# EAGLE design AUTO_plat (EAGLE 7.0.0)
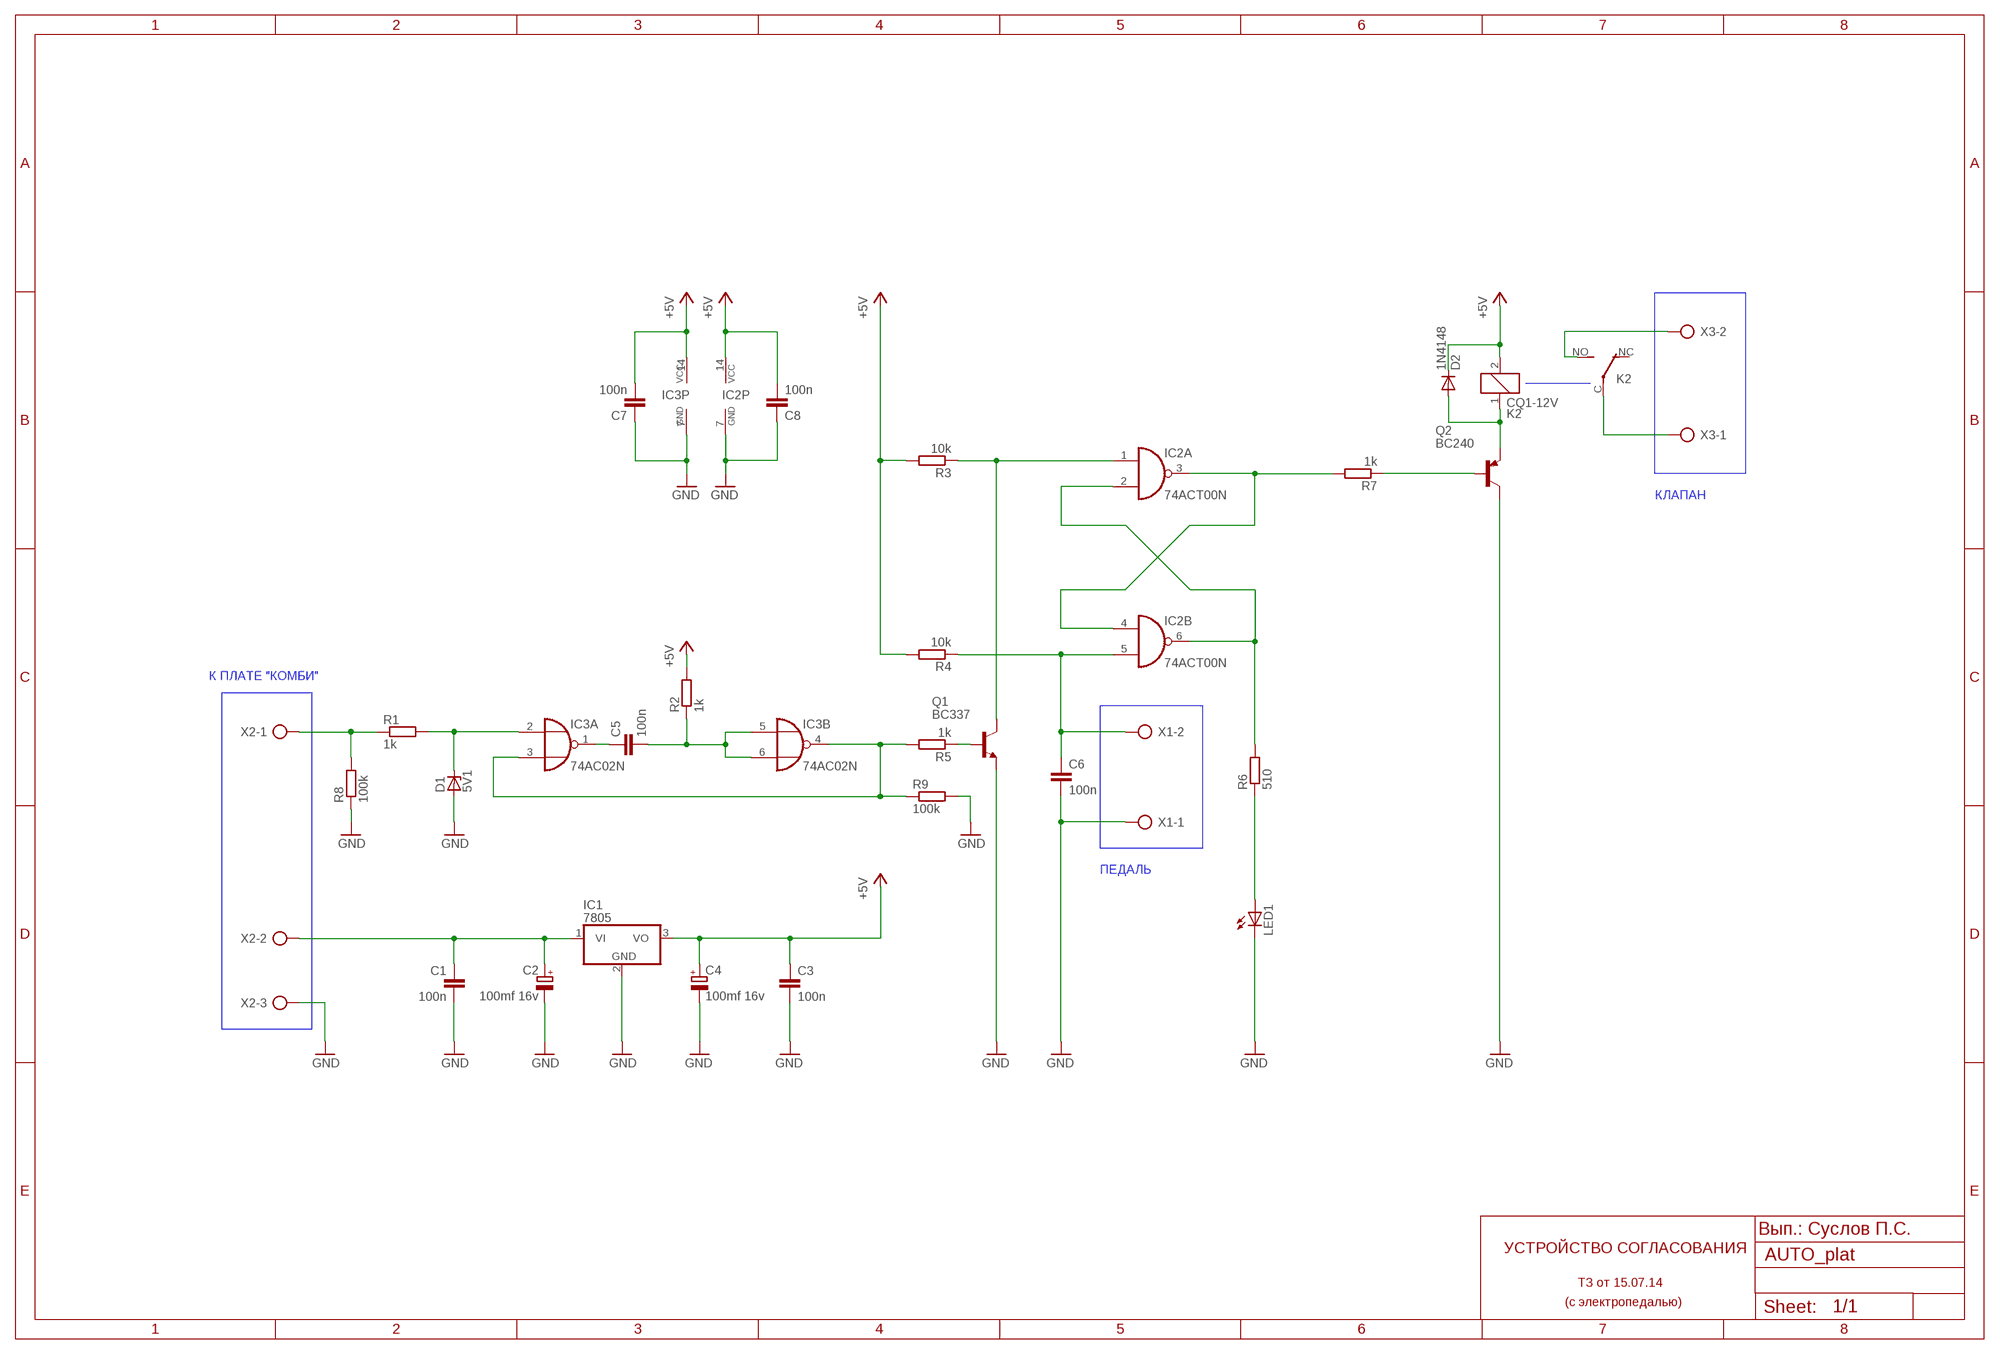
[diagram p0: schematic, sheet 1]

## Parts
C1  100n  C-EU025-030X050  [C025-030X050]
C2  100mf 16v  CPOL-EUE3.5-8  [E3,5-8]
C3  100n  C-EU025-030X050  [C025-030X050]
C4  100mf 16v  CPOL-EUE3.5-8  [E3,5-8]
C5  100n  C-EU025-030X050  [C025-030X050]
C6  100n  C-EU025-030X050  [C025-030X050]
C7  100n  C-EU025-030X050  [C025-030X050]
C8  100n  C-EU025-030X050  [C025-030X050]
D1  5V1  1N4728  [DO41Z10]
D2  1N4148  1N4148DO35-10  [DO35-10]
IC1  7805  786TV  [TO220V]
IC2  74ACT00N  [DIL14]
IC3  74AC02N  [DIL14]
K2  CQ1-12V  [CQ1]
LED1  LED3MM  [LED3MM]
Q1  BC337  [TO92]
Q2  BC240  BD240  [TO220]
R1  1k  R-EU_0207/10  [0207/10]
R2  1k  R-EU_0207/10  [0207/10]
R3  10k  R-EU_0207/10  [0207/10]
R4  10k  R-EU_0207/10  [0207/10]
R5  1k  R-EU_0207/10  [0207/10]
R6  510  R-EU_0207/10  [0207/10]
R7  1k  R-EU_0207/10  [0207/10]
R8  100k  R-EU_0207/10  [0207/10]
R9  100k  R-EU_0207/10  [0207/10]
X1  AK500/2  [AK500/2]
X2  AK500/3  [AK500/3]
X3  AK500/2  [AK500/2]

## Nets
+5V: C3.1 C4.+ C7.2 C8.2 D2.C IC1.3(VO) IC2.14(P:VCC) IC3.14(P:VCC) K2.2 R2.2 R3.2 R4.2
GND: C1.2 C2.- C3.2 C4.- C6.2 C7.1 C8.1 D1.A IC1.2(GND) IC2.7(P:GND) IC3.7(P:GND) LED1.K(C) Q1.1(E) Q2.2(C) R8.1 R9.2 X1.1 X2.3
N$1: C1.1 C2.+ IC1.1(VI) X2.2
N$4: R1.1 R8.2 X2.1
N$5: D1.C IC3.2(A:I0) R1.2
N$6: C5.1 IC3.1(A:O)
N$7: C5.2 IC3.5(B:I0) IC3.6(B:I1) R2.1
N$8: IC3.3(A:I1) IC3.4(B:O) R5.2 R9.1
N$9: IC2.3(A:O) IC2.4(B:I0) R7.2
N$10: IC2.2(A:I1) IC2.6(B:O) R6.2
N$11: IC2.1(A:I0) Q1.3(C) R3.1
N$13: C6.1 IC2.5(B:I1) R4.1 X1.2
N$15: Q1.2(B) R5.1
N$16: LED1.A R6.1
N$17: Q2.1(B) R7.1
N$18: D2.A K2.1 Q2.3(E)
N$21: K2.C(2:P) X3.1
N$22: K2.NO(2:S) X3.2
Unconnected: IC2.8(C:O) IC2.9(C:I0) IC2.10(C:I1) IC2.11(D:O) IC2.12(D:I0) IC2.13(D:I1) IC3.8(C:I0) IC3.9(C:I1) IC3.10(C:O) IC3.11(D:I0) IC3.12(D:I1) IC3.13(D:O) K2.NC(2:O)

## Notes on the sheet
- КЛАПАН
- К ПЛАТЕ "КОМБИ"
- ПЕДАЛЬ
- Вып.: Суслов П.С.
- УСТРОЙСТВО СОГЛАСОВАНИЯ
- ТЗ от 15.07.14
- (с электропедалью)

## Library data of the parts
C1 C3 C5-C8 = rcl:C-EU: CAPACITOR, European symbol
C2 C4 = rcl:CPOL-EU: POLARIZED CAPACITOR, European symbol
D1 = diode:1N4728: Z DIODE 3.3 V, 1W, 5 percent
D2 = diode:1N4148: DIODE high speed (Philips)
IC1 = linear:78*: Positive VOLTAGE REGULATOR Source: http://cache.national.com/ds/LM/LM78L05.pdf http://www.fairchildsemi.com/ds/LM/LM7805.pdf
IC2 = 74xx-eu:74*00: Quad 2-input NAND gate
IC3 = 74xx-eu:74*02: Quad 2-input NOR gate
K2 = relay:CQ1-12V: AUTOMOTIVE QUIET RELAY NAiS Source: http://www.mew-europe.com/.. en_ds_61208_0000.pdf; OC_FARNELL: unknown; OC_NEWARK: unknown
LED1 = led:LED: LED OSRAM: - CHIPLED LG R971, LG N971, LY N971, LG Q971, LY Q971, LO R971, LY R971 LH N974, LH R974 LS Q976, LO Q976, LY Q976 LO Q996 - Hyper CHIPLED LW Q18S LB Q993, LB Q99A, LB R99A - SideLED LS A670, LO A670, LY A670, LG A670, LP A670 LB A673, LV A673, LT A673, LW A673 LH A674 LY A675 LS A676, LA A676, LO A676, LY A676, LW A676 LS A679, LY A679, LG A679 - Hyper Micro SIDELED® LS Y876, LA Y876, LO Y876, LY Y876 LT Y87S - SmartLED LW L88C, LW L88S LB L89C, LB L89S, LG L890 LS L89K, LO L89K, LY L89K LS L896, LA L896, LO L896, LY L896 - TOPLED LS T670, LO T670, LY T670, LG T670, LP T670 LSG T670, LSP T670, LSY T670, LOP T670, LYG T670 LG T671, LOG T671, LSG T671 LB T673, LV T673, LT T673, LW T673 LH T674 LS T676, LA T676, LO T676, LY T676, LB T676, LH T676, LSB T676, LW T676 LB T67C, LV T67C, LT T67C, LS T67K, LO T67K, LY T67K, LW E67C LS E67B, LA E67B, LO E67B, LY E67B, LB E67C, LV E67C, LT E67C LW T67C LS T679, LY T679, LG T679 LS T770, LO T770, LY T770, LG T770, LP T770 LB T773, LV T773, LT T773, LW T773 LH T774 LS E675, LA E675, LY E675, LS T675 LS T776, LA T776, LO T776, LY T776, LB T776 LHGB T686 LT T68C, LB T68C - Hyper Mini TOPLED® LB M676 - Mini TOPLED Santana® LG M470 LS M47K, LO M47K, LY M47K Source: http://www.osram.convergy.de LUXEON: - LUMILED® LXK2-PW12-R00, LXK2-PW12-S00, LXK2-PW14-U00, LXK2-PW14-V00 LXK2-PM12-R00, LXK2-PM12-S00, LXK2-PM14-U00 LXK2-PE12-Q00, LXK2-PE12-R00, LXK2-PE12-S00, LXK2-PE14-T00, LXK2-PE14-U00 LXK2-PB12-K00, LXK2-PB12-L00, LXK2-PB12-M00, LXK2-PB14-N00, LXK2-PB14-P00, LXK2-PB14-Q00 LXK2-PR12-L00, LXK2-PR12-M00, LXK2-PR14-Q00, LXK2-PR14-R00 LXK2-PD12-Q00, LXK2-PD12-R00, LXK2-PD12-S00 LXK2-PH12-R00, LXK2-PH12-S00 LXK2-PL12-P00, LXK2-PL12-Q00, LXK2-PL12-R00 Source: www.luxeon.com KINGBRIGHT: KA-3528ASYC Source: www.kingbright.com
Q1 = transistor-npn:BC337*: NPN Transistor
Q2 = transistor-pnp:BD240: PNP Transistor
R1-R9 = rcl:R-EU_: RESISTOR, European symbol
X1 X3 = con-ptr500:AK500/2: CONNECTOR; OC_FARNELL: unknown; OC_NEWARK: unknown
X2 = con-ptr500:AK500/3: CONNECTOR; OC_FARNELL: unknown; OC_NEWARK: unknown

## Board
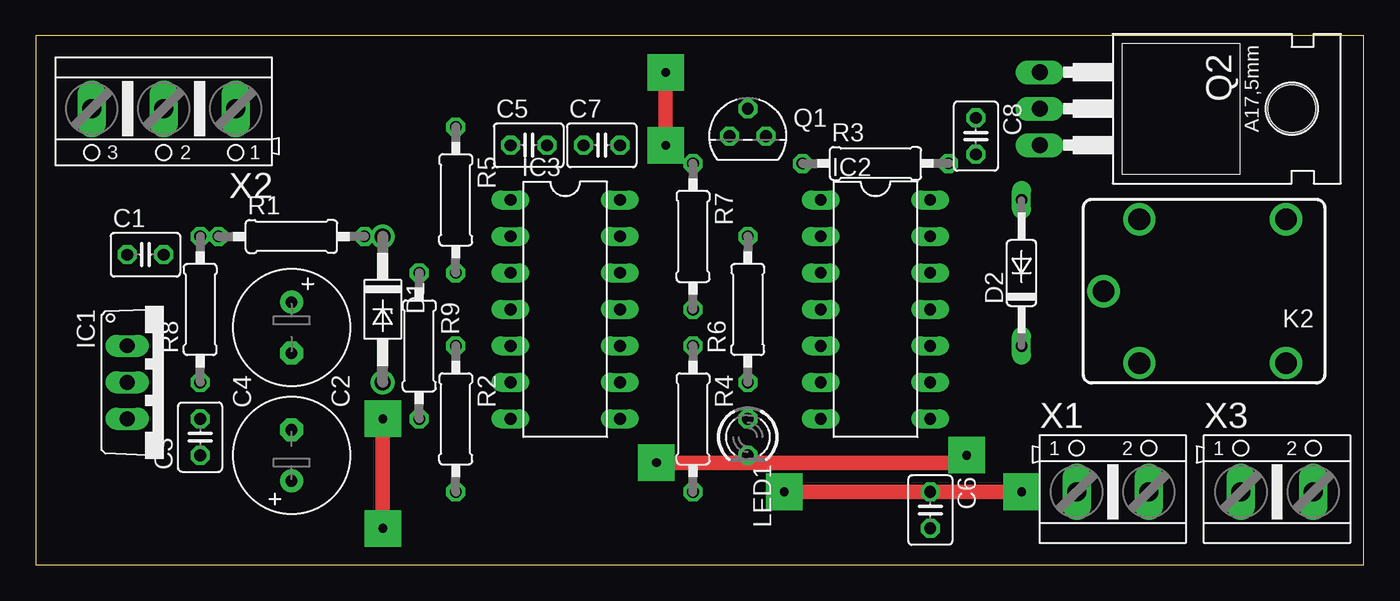
[diagram p1: board, top side]
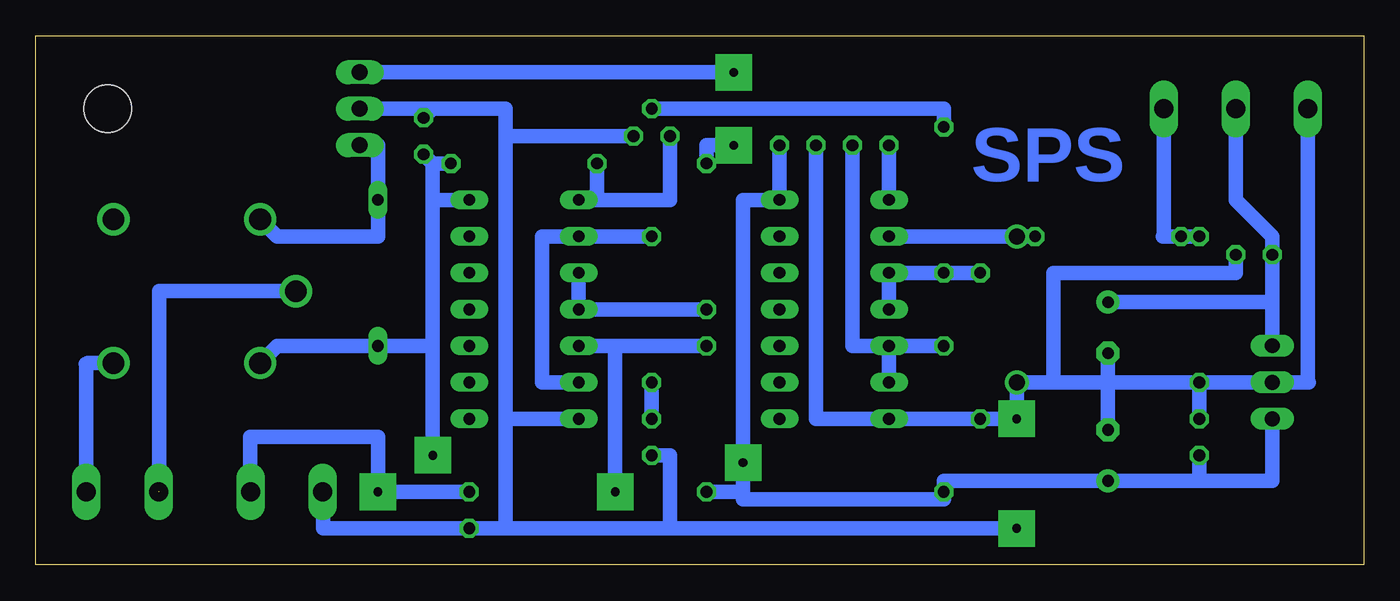
[diagram p2: board, bottom side, seen from below]

Size 92.38 x 36.82 mm. Coordinates in mm from the lower left corner, seen from the top.
Outline: 0,0 92.38,0 92.38,36.82 0,36.82 0,0
Copper layers (1*16): Top 0.035mm / dielectric 1.5mm / Bottom 0.035mm
Design rules "default": minimum track width 10mil, minimum drill 24mil, track to track 8mil, track to pad 8mil, pad to pad 8mil, via to via 8mil, smd to smd 8mil, copper to edge 40mil, drill to drill 8mil, minimum pad ring 10mil, minimum via ring 8mil, stop-mask expansion 4mil, vias tented up to drill 0mil, thermal gap 10mil

### Footprints (pad centres in the part's own frame; a part is rotated, then mirrored left to right if it is on the bottom)
C025-030X050 = drill 0.813 octagon: 1 -1.27,0; 2 1.27,0
E3,5-8 = drill 0.813 pad 1.6: + -1.778,0 | drill 0.813 pad 1.6 octagon: - 1.778,0
DO41Z10 = drill 1.118: A 5.08,0; C -5.08,0
DO35-10 = drill 0.813 long: A 5.08,0; C -5.08,0
TO220V = drill 1.016 long: 1 -2.54,-2.54; 2 0,-2.54; 3 2.54,-2.54
DIL14 = drill 0.813 long: 1 -7.62,-3.81; 2 -5.08,-3.81; 3 -2.54,-3.81; 4 0,-3.81; 5 2.54,-3.81; 6 5.08,-3.81; 7 7.62,-3.81; 8 7.62,3.81; 9 5.08,3.81; 10 2.54,3.81; 11 0,3.81; 12 -2.54,3.81; 13 -5.08,3.81; 14 -7.62,3.81
CQ1 = drill 1.5: 1 4.5,-5; 2 4.5,5; C 7,0; NC -5.7,-5; NO -5.7,5
LED3MM = drill 0.813 octagon: A -1.27,0; K 1.27,0
TO92 = drill 0.813 octagon: 1 1.27,0; 2 0,1.905; 3 -1.27,0
TO220 = drill 1.118 long: 1 -2.54,-6.35; 2 0,-6.35; 3 2.54,-6.35 | hole 3.302: 0,11.176
0207/10 = drill 0.813 octagon: 1 -5.08,0; 2 5.08,0
AK500/2 = drill 1.321 long: 1 -2.515,0; 2 2.515,0
AK500/3 = drill 1.321 long: 1 -5.004,0; 2 0,0; 3 5.004,0

### Placement (x,y rotation side)
C1  7.62,21.59 0 top
C2  17.78,16.51 270 top
C3  11.43,8.89 90 top
C4  17.78,7.62 90 top
C5  34.29,29.21 0 top
C6  62.23,3.81 270 top
C7  39.37,29.21 0 top
C8  65.41,29.84 270 top
D1  24.13,17.78 270 top
D2  68.58,20.32 90 top
IC1  8.89,12.7 270 top
IC2  58.42,17.78 270 top
IC3  36.83,17.78 270 top
K2  81.28,19.05 180 top
LED1  49.53,8.89 270 top
Q1  49.53,29.84 0 top
Q2  76.2,31.75 270 top
R1  17.78,22.86 0 top
R2  29.21,10.16 270 top
R3  58.42,27.94 0 top
R4  45.72,10.16 270 top
R5  29.21,25.4 270 top
R6  49.53,17.78 90 top
R7  45.72,22.86 270 top
R8  11.43,17.78 90 top
R9  26.67,15.24 270 top
X1  74.93,5.08 0 top
X2  8.89,31.75 180 top
X3  86.36,5.08 0 top

### Tracks (layer width: path | path; a pad name or v marks a point on that pad's centre or on a via)
+5V  (via drill 0.6 pad 2.54)
  Top 1.016: v43.18,7.11 64.77,7.11 v64.77,7.62
  Bottom 1.016: IC1.3 6.35,5.84 11.43,5.84 | 11.43,5.84 C4.+ 29.21,5.84 R2.2 29.21,4.57 43.18,4.57 v43.18,7.11 | v43.18,7.11 43.18,25.4 IC3.14 C7.2 | R3.2 64.77,27.94 | 64.77,27.94 64.77,25.4 | IC2.14 64.77,25.4 | 64.77,25.4 64.77,15.24 | 64.77,15.24 v64.77,7.62 | R4.2 43.18,5.08 v43.18,7.11 | 64.77,15.24 D2.C 75.59,15.24 K2.2 | C3.1 11.43,5.84 | C8.2 64.77,27.94
GND  (via drill 0.6 pad 2.54)
  Top 1.016: v24.13,10.16 v24.13,2.54
  Bottom 1.016: R8.1 IC1.2 3.81,12.7 3.89,12.78 X2.3 | R8.1 17.78,12.7 | 17.78,12.7 C2.- | C4.- 17.78,12.7 | 21.59,12.7 D1.A v24.13,10.16 R9.2 IC3.7 38.1,10.16 C7.1 | 21.59,12.7 17.78,12.7 | Q1.1 59.69,29.84 | 59.69,29.84 59.69,10.16 | 59.69,10.16 IC2.7 | v24.13,2.54 48.26,2.54 | 48.26,2.54 59.69,2.54 | 59.69,2.54 59.69,10.16 | X1.1 72.39,2.54 C6.2 59.69,2.54 | LED1.K 48.26,7.62 48.26,2.54 | C1.2 8.89,20.32 21.59,20.32 21.59,12.7 | 59.69,29.84 59.69,31.75 64.77,31.75 | 64.77,31.75 Q2.2 | C3.2 R8.1 | C8.1 64.77,31.75
N$1
  Bottom 1.016: C2.+ 6.35,18.29 | IC1.1 6.35,18.29 | 6.35,18.29 C1.1 6.35,22.86 8.89,25.4 X2.2
N$4
  Bottom 1.016: 11.43,22.78 R8.2 | R1.1 R8.2 | X2.1 13.89,22.94 13.97,22.86 R8.2
N$5
  Bottom 1.016: R1.2 D1.C IC3.2
N$6
  Bottom 1.016: C5.1 IC3.1
N$7
  Bottom 1.016: IC3.5 R2.1 | IC3.6 IC3.5 | C5.2 35.56,15.24 IC3.5
N$8
  Bottom 1.016: IC3.4 IC3.3 R5.2 R9.1
N$9
  Bottom 1.016: IC2.3 IC2.4 R7.2
N$10
  Bottom 1.016: IC2.6 57.15,12.7 57.15,22.86 IC2.2 R6.2
N$11
  Bottom 1.016: 53.34,25.4 48.26,25.4 Q1.3 | 53.34,25.4 IC2.1 | R3.1 53.34,25.4
N$13  (via drill 0.6 pad 2.54)
  Top 1.016: v68.58,5.08 v52.07,5.08
  Bottom 1.016: R4.1 52.07,15.24 | 52.07,15.24 IC2.5 | v52.07,5.08 52.07,15.24 | C6.1 v68.58,5.08 68.58,8.89 77.47,8.89 77.47,5.08 X1.2
N$15
  Bottom 1.016: R5.1 29.21,31.75 Q1.2
N$16
  Bottom 1.016: LED1.A R6.1
N$17  (via drill 0.6 pad 2.54)
  Top 1.016: v43.82,29.21 v43.82,34.29
  Bottom 1.016: R7.1 45.72,29.21 v43.82,29.21 | v43.82,34.29 Q2.1
N$18
  Bottom 1.016: Q2.3 68.58,29.21 D2.A 68.58,22.86 75.59,22.86 K2.1
N$21  (1 unrouted)
  Bottom 1.016: K2.C 83.82,19.05 83.82,5.08
N$22
  Bottom 1.016: X3.2 88.88,13.94 | 88.88,13.94 88.9,13.97 | K2.NO 88.77,14.05 88.88,13.94

### Text on the board
Bottom: SPS